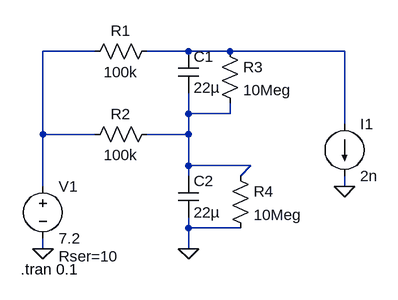
[diagram p0: schematic cap_leakage.asc]
cap_leakage.asc, the LTspice schematic file:
Version 4
SHEET 1 880 680
WIRE 96 48 16 48
WIRE 240 48 176 48
WIRE 304 48 240 48
WIRE 480 48 304 48
WIRE 240 144 240 112
WIRE 304 144 304 128
WIRE 304 144 240 144
WIRE 480 160 480 48
WIRE 16 176 16 48
WIRE 96 176 16 176
WIRE 240 176 240 144
WIRE 240 176 176 176
WIRE 240 224 240 176
WIRE 336 224 240 224
WIRE 240 240 240 224
WIRE 320 240 336 224
WIRE 16 256 16 176
WIRE 480 256 480 240
WIRE 240 320 240 304
WIRE 320 320 240 320
WIRE 16 352 16 336
WIRE 240 352 240 320
FLAG 16 352 0
FLAG 480 256 0
FLAG 240 352 0
SYMBOL voltage 16 240 R0
WINDOW 123 0 0 Left 0
WINDOW 39 24 124 Left 2
SYMATTR InstName V1
SYMATTR Value 7.2
SYMATTR SpiceLine Rser=10
SYMBOL current 480 160 R0
WINDOW 123 0 0 Left 0
WINDOW 39 0 0 Left 0
SYMATTR InstName I1
SYMATTR Value 2n
SYMBOL res 192 32 R90
WINDOW 0 0 56 VBottom 2
WINDOW 3 32 56 VTop 2
SYMATTR InstName R1
SYMATTR Value 100k
SYMBOL res 192 160 R90
WINDOW 0 0 56 VBottom 2
WINDOW 3 32 56 VTop 2
SYMATTR InstName R2
SYMATTR Value 100k
SYMBOL cap 224 48 R0
SYMATTR InstName C1
SYMATTR Value 22µ
SYMBOL cap 224 240 R0
SYMATTR InstName C2
SYMATTR Value 22µ
SYMBOL res 288 32 R0
SYMATTR InstName R3
SYMATTR Value 10Meg
SYMBOL res 304 224 R0
SYMATTR InstName R4
SYMATTR Value 10Meg
TEXT -18 384 Left 2 !.tran 0.1

The netlist it stands for:
* cap_leakage.asc
V1 N001 0 7.2 Rser=10
I1 N002 0 2n
R1 N002 N001 100k
R2 N003 N001 100k
C1 N002 N003 22µ
C2 N003 0 22µ
R3 N002 N003 10Meg
R4 N003 0 10Meg
.tran 0.1
.backanno
.end